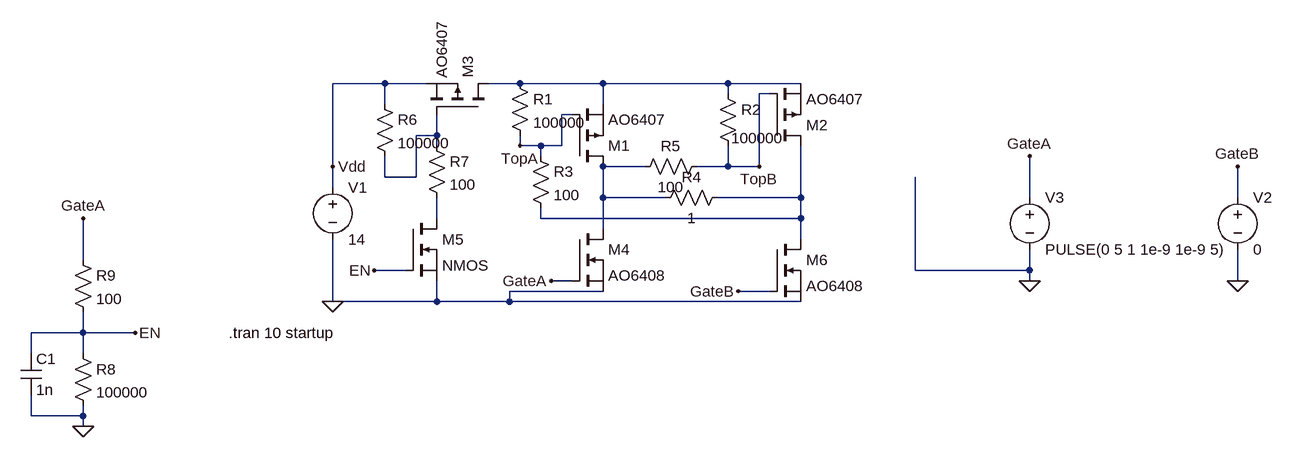
[diagram p0: schematic P-MOSFET_MotorDrive2.asc]
P-MOSFET_MotorDrive2.asc, the LTspice schematic file:
Version 4
SHEET 1 1624 680
WIRE -144 48 -224 48
WIRE -80 48 -144 48
WIRE 64 48 16 48
WIRE 192 48 64 48
WIRE 384 48 192 48
WIRE 496 48 384 48
WIRE 384 64 384 48
WIRE 448 64 432 64
WIRE -144 80 -144 48
WIRE 192 80 192 48
WIRE 144 96 128 96
WIRE -64 128 -64 96
WIRE -64 128 -96 128
WIRE -64 144 -64 128
WIRE 64 144 64 128
WIRE 96 144 64 144
WIRE 128 144 128 96
WIRE 128 144 96 144
WIRE 96 160 96 144
WIRE -224 176 -224 48
WIRE 256 176 192 176
WIRE 384 176 384 144
WIRE 384 176 336 176
WIRE 432 176 432 64
WIRE 432 176 384 176
WIRE -144 192 -144 160
WIRE -96 192 -96 128
WIRE -96 192 -144 192
WIRE -224 208 -224 176
WIRE 192 224 192 176
WIRE 288 224 192 224
WIRE 496 224 496 144
WIRE 496 224 368 224
WIRE 848 224 848 160
WIRE 1168 224 1168 176
WIRE -64 256 -64 224
WIRE 96 256 96 240
WIRE 496 256 496 224
WIRE 496 256 96 256
WIRE 192 272 192 224
WIRE 496 288 496 256
WIRE -608 320 -608 256
WIRE -112 336 -160 336
WIRE 672 336 672 192
WIRE 848 336 848 304
WIRE 848 336 672 336
WIRE 144 352 112 352
WIRE 848 352 848 336
WIRE 1168 352 1168 304
WIRE 192 368 48 368
WIRE 448 368 400 368
WIRE -224 384 -224 288
WIRE -64 384 -64 352
WIRE -64 384 -224 384
WIRE 48 384 48 368
WIRE 48 384 -64 384
WIRE 496 384 48 384
WIRE -608 432 -608 400
WIRE -608 432 -688 432
WIRE -528 432 -608 432
WIRE -688 464 -688 432
WIRE -608 464 -608 432
WIRE -688 560 -688 528
WIRE -608 560 -608 544
WIRE -608 560 -688 560
WIRE -608 576 -608 560
FLAG -224 384 0
FLAG 1168 352 0
FLAG 1168 176 GateB
FLAG 400 368 GateB
FLAG 848 352 0
FLAG 848 160 GateA
FLAG 112 352 GateA
FLAG -224 176 Vdd
FLAG 64 144 TopA
FLAG 432 176 TopB
FLAG -528 432 EN
FLAG -160 336 EN
FLAG -608 576 0
FLAG -608 256 GateA
SYMBOL pmos 144 176 M180
SYMATTR InstName M1
SYMATTR Value AO6407
SYMBOL pmos 448 144 M180
SYMATTR InstName M2
SYMATTR Value AO6407
SYMBOL nmos 144 272 R0
SYMATTR InstName M4
SYMATTR Value AO6408
SYMBOL nmos 448 288 R0
SYMATTR InstName M6
SYMATTR Value AO6408
SYMBOL voltage -224 192 R0
WINDOW 123 0 0 Left 0
WINDOW 39 0 0 Left 0
SYMATTR InstName V1
SYMATTR Value 14
SYMBOL voltage 1168 208 R0
WINDOW 123 0 0 Left 0
WINDOW 39 0 0 Left 0
SYMATTR InstName V2
SYMATTR Value 0
SYMBOL res 48 32 R0
SYMATTR InstName R1
SYMATTR Value 100000
SYMBOL res 368 48 R0
WINDOW 3 21 84 Left 2
SYMATTR InstName R2
SYMATTR Value 100000
SYMBOL res 384 208 R90
WINDOW 0 0 56 VBottom 2
WINDOW 3 32 56 VTop 2
SYMATTR InstName R4
SYMATTR Value 1
SYMBOL voltage 848 208 R0
WINDOW 123 0 0 Left 0
WINDOW 39 0 0 Left 0
SYMATTR InstName V3
SYMATTR Value PULSE(0 5 1 1e-9 1e-9 5)
SYMBOL res 80 144 R0
SYMATTR InstName R3
SYMATTR Value 100
SYMBOL res 352 160 R90
WINDOW 0 0 56 VBottom 2
WINDOW 3 32 56 VTop 2
SYMATTR InstName R5
SYMATTR Value 100
SYMBOL pmos 16 96 M270
SYMATTR InstName M3
SYMATTR Value AO6407
SYMBOL nmos -112 256 R0
SYMATTR InstName M5
SYMBOL res -160 64 R0
SYMATTR InstName R6
SYMATTR Value 100000
SYMBOL res -80 128 R0
SYMATTR InstName R7
SYMATTR Value 100
SYMBOL res -624 448 R0
SYMATTR InstName R8
SYMATTR Value 100000
SYMBOL res -624 304 R0
SYMATTR InstName R9
SYMATTR Value 100
SYMBOL cap -704 464 R0
SYMATTR InstName C1
SYMATTR Value 1n
TEXT -384 432 Left 2 !.tran 10 startup

The netlist it stands for:
* P-MOSFET_MotorDrive2.asc
M1 N003 TopA N001 N001 AO6407
M2 N004 TopB N001 N001 AO6407
M4 N003 GateA 0 0 AO6408
M6 N004 GateB 0 0 AO6408
V1 Vdd 0 14
V2 GateB 0 0
R1 N001 TopA 100000
R2 N001 TopB 100000
R4 N004 N003 1
V3 GateA 0 PULSE(0 5 1 1e-9 1e-9 5)
R3 TopA N004 100
R5 TopB N003 100
M3 N001 N002 Vdd Vdd AO6407
M5 N005 EN 0 0 NMOS
R6 Vdd N002 100000
R7 N002 N005 100
R8 EN 0 100000
R9 GateA EN 100
C1 EN 0 1n
.model NMOS NMOS
.model PMOS PMOS
.lib standard.mos
.tran 10 startup
.backanno
.end